# Altium schematic sheet stepper_motor_control_sch.SchDoc
size A3; PageSetup: Record=PageOptions|CenterHorizontal=True|CenterVertical=True|PrintScale=0.73|XCorrection=1.00|YCorrection=1.00|PrintKind=1|BorderSize=5000000|LeftOffset=0|BottomOffset=0|Orientation=2|PaperLength=1000|PaperWidth=1000|Scale=100|PaperSource=7|PrintQuality=600|MediaType=1|DitherType=10|PrintScaleMode=1|PaperKind=A4|PaperIndex=9
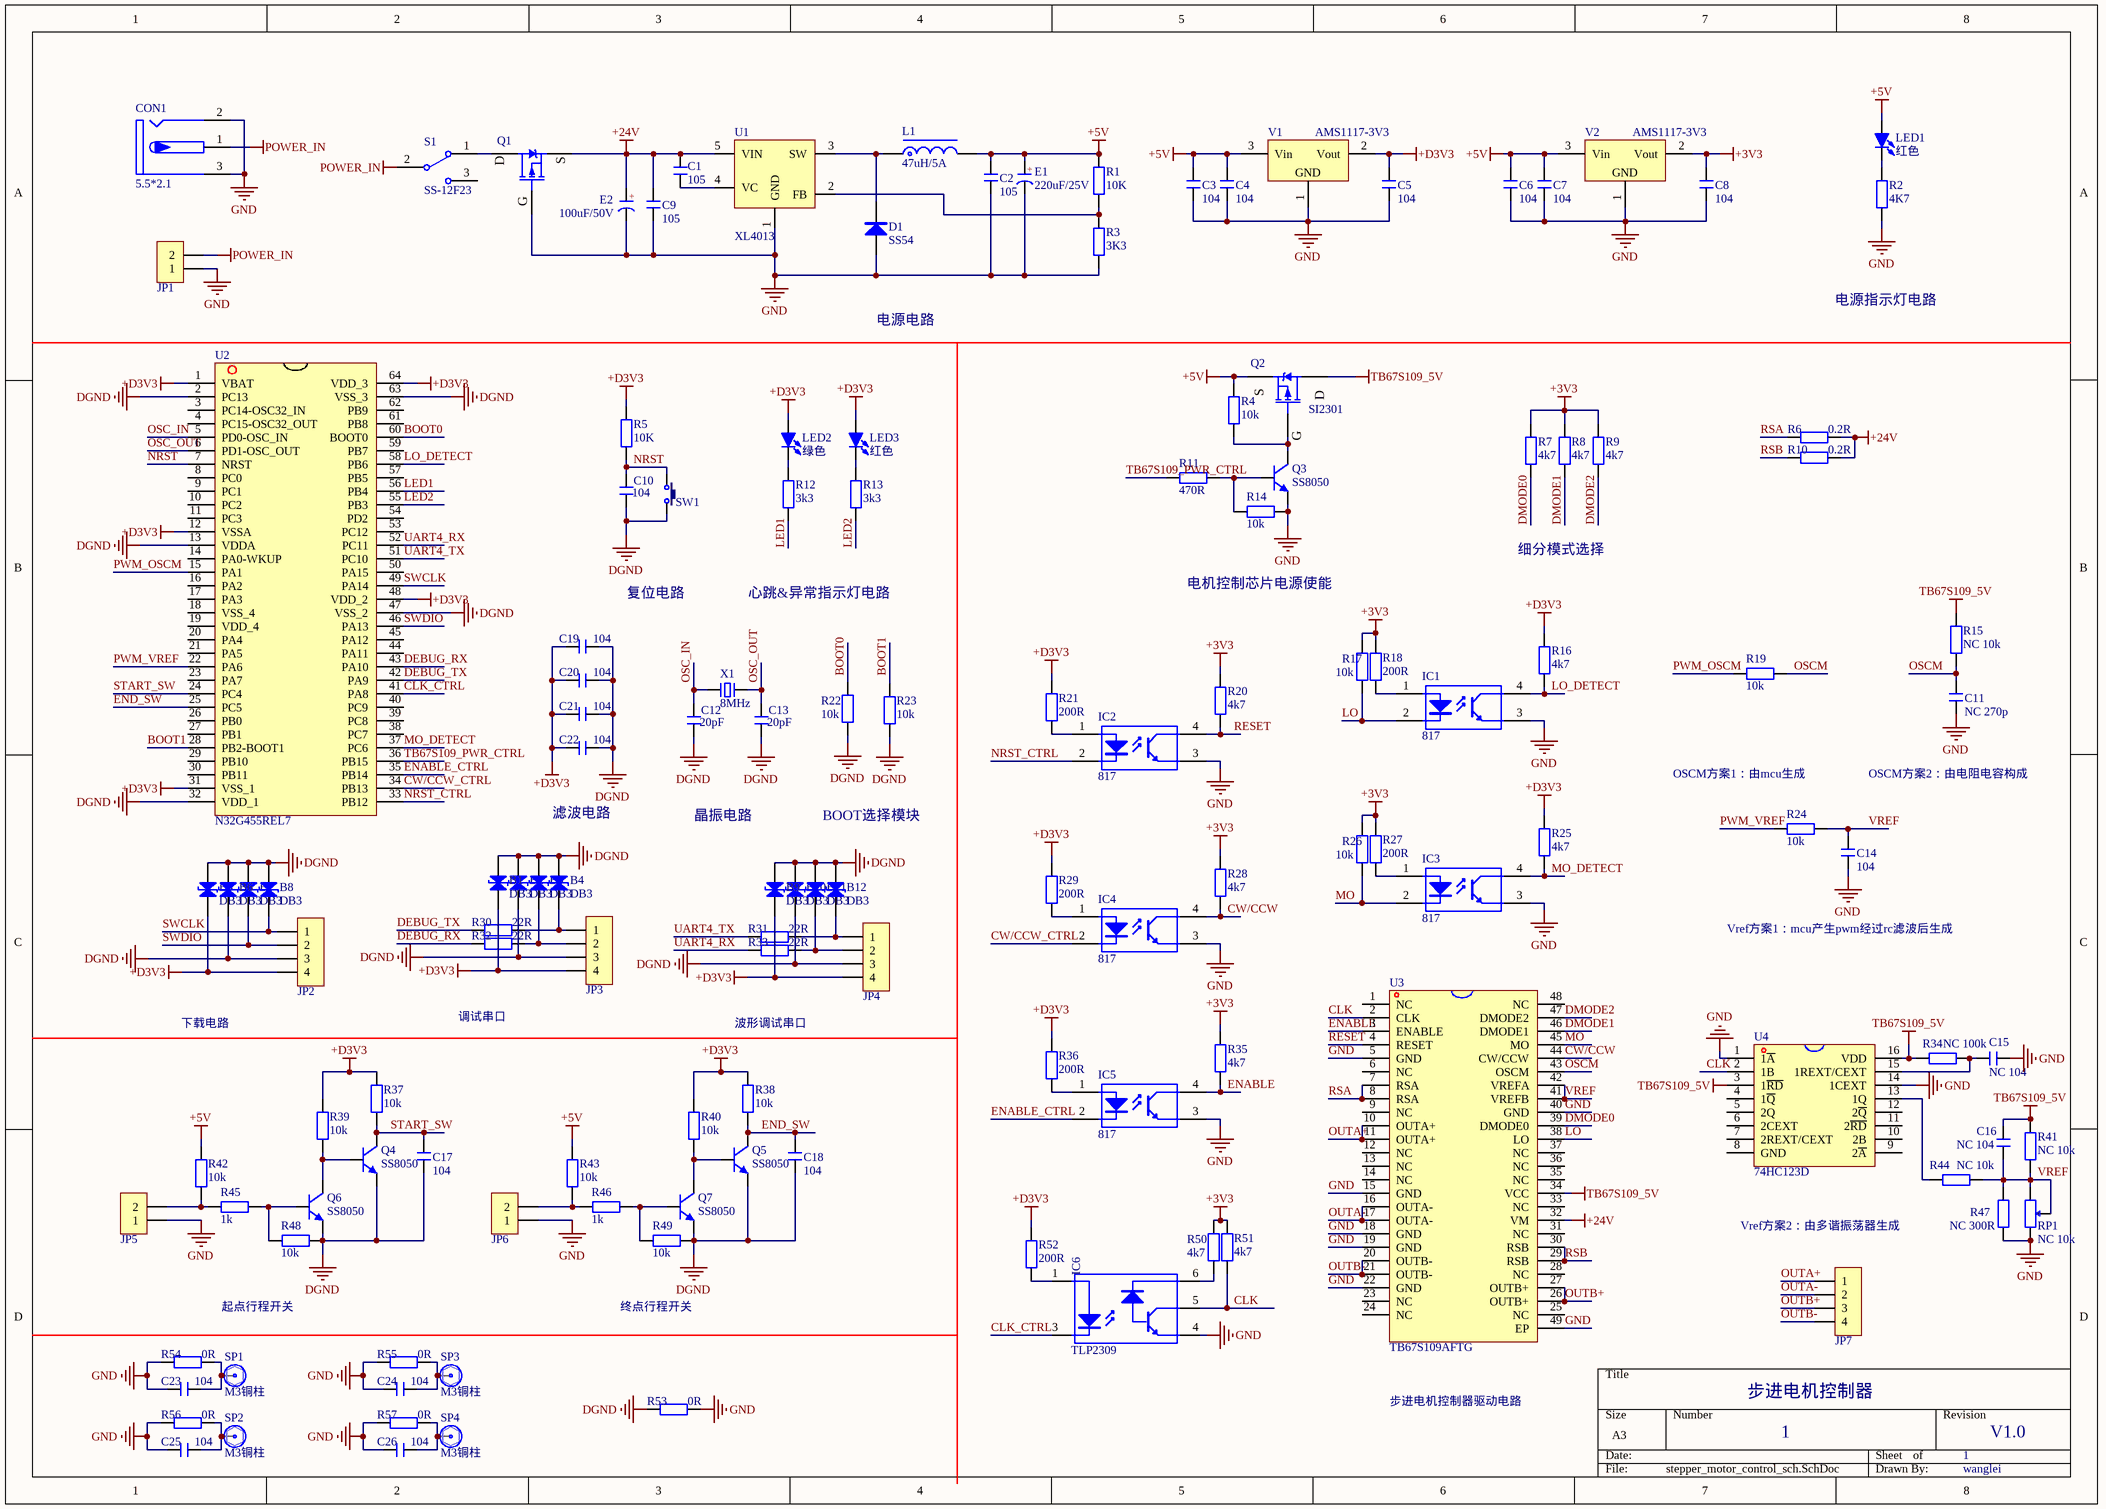
[diagram p0: stepper_motor_control_sch.SchDoc]

## Parts
B1  DB3  [SOD-323]
B2  DB3  [SOD-323]
B3  DB3  [SOD-323]
B4  DB3  [SOD-323]
B5  DB3  [SOD-323]
B6  DB3  [SOD-323]
B7  DB3  [SOD-323]
B8  DB3  [SOD-323]
B9  DB3  [SOD-323]
B10  DB3  [SOD-323]
B11  DB3  [SOD-323]
B12  DB3  [SOD-323]
C1  105  [C 0603_M]
C2  105  [C 0603_M]
C3  104  [C 0603_M]
C4  104  [C 0603_M]
C5  104  [C 0603_M]
C6  104  [C 0603_M]
C7  104  [C 0603_M]
C8  104  [C 0603_M]
C9  105  [C 0603_M]
C10  104  [C 0603_M]
C11  NC 270p  [C 0603_M]
C12  20pF  [C 0603_M]
C13  20pF  [C 0603_M]
C14  104  [C 0603_M]
C15  NC 104  [C 0603_M]
C16  NC 104  [C 0603_M]
C17  104  [C 0603_M]
C18  104  [C 0603_M]
C19  104  [C 0603_M]
C20  104  [C 0603_M]
C21  104  [C 0603_M]
C22  104  [C 0603_M]
C23  104  [C 0603_M]
C24  104  [C 0603_M]
C25  104  [C 0603_M]
C26  104  [C 0603_M]
CON1  5.5*2.1  [DC-005]
D1  SS54  [SMB]
E1  220uF/25V  [CAP 2.5*6.3*11.2 - BK]
E2  100uF/50V  [CAP 3.5*8*11.5 - BK]
IC1  817  [SMD]
IC2  817  [SMD]
IC3  817  [SMD]
IC4  817  [SMD]
IC5  817  [SMD]
IC6  TLP2309  [SO-6]
JP1  HDR-1X2  [KF350-2P]  (value not drawn)
JP2  HDR-1X4  [MX 1.25-WS-4P]  (value not drawn)
JP3  HDR-1X4  [MX 1.25-WS-4P]  (value not drawn)
JP4  HDR-1X4  [MX 1.25-WS-4P]  (value not drawn)
JP5  HDR-1X2  [XH2.54-LI-2P]  (value not drawn)
JP6  HDR-1X2  [XH2.54-LI-2P]  (value not drawn)
JP7  HDR-1X4  [KF350-4P]  (value not drawn)
L1  47uH/5A  [LMR135]
LED1  红色  [LED 0805W]
LED2  绿色  [LED 0805W]
LED3  红色  [LED 0805W]
Q1  D15P05  [TO252]  (value not drawn)
Q2  SI2301  [SOT23-3N]
Q3  SS8050  [SOT23-3N]
Q4  SS8050  [SOT23-3N]
Q5  SS8050  [SOT23-3N]
Q6  SS8050  [SOT23-3N]
Q7  SS8050  [SOT23-3N]
R1  10K  [R 0603_M]
R2  4K7  [R 0603_M]
R3  3K3  [R 0603_M]
R4  10k  [R 0603_M]
R5  10K  [R 0603_M]
R6  0.2R  [R 2010_M]
R7  4k7  [R 0603_M]
R8  4k7  [R 0603_M]
R9  4k7  [R 0603_M]
R10  0.2R  [R 2010_M]
R11  470R  [R 0603_M]
R12  3k3  [R 0603_M]
R13  3k3  [R 0603_M]
R14  10k  [R 0603_M]
R15  NC 10k  [R 0603_M]
R16  4k7  [R 0603_M]
R17  10k  [R 0603_M]
R18  200R  [R 0603_M]
R19  10k  [R 0603_M]
R20  4k7  [R 0603_M]
R21  200R  [R 0603_M]
R22  10k  [R 0603_M]
R23  10k  [R 0603_M]
R24  10k  [R 0603_M]
R25  4k7  [R 0603_M]
R26  10k  [R 0603_M]
R27  200R  [R 0603_M]
R28  4k7  [R 0603_M]
R29  200R  [R 0603_M]
R30  22R  [R 0603_M]
R31  22R  [R 0603_M]
R32  22R  [R 0603_M]
R33  22R  [R 0603_M]
R34  NC 100k  [R 0603_M]
R35  4k7  [R 0603_M]
R36  200R  [R 0603_M]
R37  10k  [R 0603_M]
R38  10k  [R 0603_M]
R39  10k  [R 0603_M]
R40  10k  [R 0603_M]
R41  NC 10k  [R 0603_M]
R42  10k  [R 0603_M]
R43  10k  [R 0603_M]
R44  NC 10k  [R 0603_M]
R45  1k  [R 0603_M]
R46  1k  [R 0603_M]
R47  NC 300R  [R 0603_M]
R48  10k  [R 0603_M]
R49  10k  [R 0603_M]
R50  4k7  [R 0603_M]
R51  4k7  [R 0603_M]
R52  200R  [R 0603_M]
R53  0R  [R 0603_M]
R54  0R  [R 0603_M]
R55  0R  [R 0603_M]
R56  0R  [R 0603_M]
R57  0R  [R 0603_M]
RP1  NC 10k  [3303W]
S1  SS-12F23  [SK12D07VG3]
SP1  M3铜柱  [M3x4+6_N]
SP2  M3铜柱  [M3x4+6_N]
SP3  M3铜柱  [M3x4+6_N]
SP4  M3铜柱  [M3x4+6_N]
SW1  3x6x5  [TSW SMD-3*6*2.5]  (value not drawn)
U1  XL4013  [TO252-5]
U2  N32G455REL7  [LQFP64 10x10_M]
U3  TB67S109AFTG  [QFN48]
U4  74HC123D  [SOP16_L]
V1  AMS1117-3V3  [SOT223_M]
V2  AMS1117-3V3  [SOT223_M]
X1  8MHz  [OSC HC-49SMD]

## Nets
+3V3: C8.1 R7.2 R8.2 R9.2 R17.1 R18.1 R20.2 R26.1 R27.1 R28.2 R35.2 R50.1 R51.1 V2.2(Vout)
+5V: C2.1 C3.1 C4.1 C6.1 C7.1 E1.1(A) L1.2 LED1.1(A) Q2.2(S) R1.2 R4.2 R42.2 R43.2 V1.3(Vin) V2.3(Vin)
+24V: C1.1 C9.1 E2.1(A) Q1.3(S) R6.2 R10.2 U1.5(VIN) U3.32(VM)
+D3V3: B1.2(K) B5.2(K) B9.2(K) C5.1 C19.2 C20.2 C21.2 C22.2 JP2.4 JP3.4 JP4.4 LED2.1(A) LED3.1(A) R5.2 R16.2 R21.1 R25.2 R29.1 R36.1 R37.1 R38.1 R39.1 R40.1 R52.1 U2.1(VBAT) U2.12(VSSA) U2.31(VSS_1) U2.48(VDD_2) U2.64(VDD_3) V1.2(Vout)
DGND: B1.1(A) B2.1(A) B2.2(K) B3.1(A) B4.1(A) B5.1(A) B6.1(A) B6.2(K) B7.1(A) B8.1(A) B9.1(A) B10.1(A) B10.2(K) B11.1(A) B12.1(A) C10.1 C12.1 C13.1 C17.2 C18.2 C19.1 C20.1 C21.1 C22.1 JP2.3 JP3.3 JP4.3 Q4.2(E) Q5.2(E) Q6.2(E) Q7.2(E) R22.1 R23.1 R48.1 R49.1 R53.1 SW1.2 U2.2(PC13) U2.13(VDDA) U2.32(VDD_1) U2.47(VSS_2) U2.63(VSS_3)
GND: C2.2 C3.2 C4.2 C5.2 C6.2 C7.2 C8.2 C9.2 C11.2 C14.2 C15.2 C23.1 C24.1 C25.1 C26.1 CON1.2 CON1.3 D1.1(A) E1.2(K) E2.2(K) IC1.3(E) IC2.3(E) IC3.3(E) IC4.3(E) IC5.3(E) IC6.4(GND) JP1.1 JP5.1 JP6.1 Q1.1(G) Q3.2(E) R2.1 R3.1 R14.2 R47.2 R53.2 R54.1 R55.1 R56.1 R57.1 RP1.3 U1.1(GND) U3.5(GND) U3.15(GND) U3.18(GND) U3.19(GND) U3.22(GND) U3.40(GND) U3.49(EP) U4.1(1~{A}) U4.14(1CEXT) V1.1(GND) V2.1(GND)
POWER_IN: CON1.1 JP1.2 S1.2
TB67S109_5V: C16.2 Q2.3(D) R15.2 R34.2 R41.1 U3.34(VCC) U4.3(1~{RD}) U4.16(VDD)
BOOT0: R22.2 U2.60(BOOT0)
BOOT1: R23.2 U2.28(PB2-BOOT1)
CLK: IC6.5(VO) R51.2 U3.2(CLK) U4.2(1B)
CLK_CTRL: IC6.3(CA) U2.41(PA8)
CW/CCW: IC4.4(C) R28.1 U3.44(CW/CCW)
CW/CCW_CTRL: IC4.2(K) U2.34(PB13)
DEBUG_RX: R32.1 U2.43(PA10)
DEBUG_TX: R30.1 U2.42(PA9)
DMODE0: R7.1 U3.39(DMODE0)
DMODE1: R8.1 U3.46(DMODE1)
DMODE2: R9.1 U3.47(DMODE2)
ENABLE: IC5.4(C) R35.1 U3.3(ENABLE)
ENABLE_CTRL: IC5.2(K) U2.35(PB14)
END_SW: C18.1 Q5.3(C) R38.2 U2.25(PC5)
LED1: R12.1 U2.56(PB4)
LED2: R13.1 U2.55(PB3)
LO: IC1.2(K) R17.2 U3.38(LO)
LO_DETECT: IC1.4(C) R16.1 U2.58(PB6)
MO: IC3.2(K) R26.2 U3.45(MO)
MO_DETECT: IC3.4(C) R25.1 U2.37(PC6)
NRST: C10.2 R5.1 SW1.1 U2.7(NRST)
NRST_CTRL: IC2.2(K) U2.33(PB12)
OSC_IN: C12.2 U2.5(PD0-OSC_IN) X1.1
OSC_OUT: C13.2 U2.6(PD1-OSC_OUT) X1.2
OSCM: C11.1 R15.1 R19.1 U3.43(OSCM)
OUTA+: JP7.1 U3.10(OUTA+) U3.11(OUTA+)
OUTA-: JP7.2 U3.16(OUTA-) U3.17(OUTA-)
OUTB+: JP7.3 U3.26(OUTB+) U3.27(OUTB+)
OUTB-: JP7.4 U3.20(OUTB-) U3.21(OUTB-)
PWM_OSCM: R19.2 U2.15(PA1)
PWM_VREF: R24.2 U2.22(PA6)
RESET: IC2.4(C) R20.1 U3.4(RESET)
RSA: R6.1 U3.7(RSA) U3.8(RSA)
RSB: R10.1 U3.29(RSB) U3.30(RSB)
START_SW: C17.1 Q4.3(C) R37.2 U2.24(PC4)
SWCLK: B8.2(K) JP2.1 U2.49(PA14)
SWDIO: B7.2(K) JP2.2 U2.46(PA13)
TB67S109_PWR_CTRL: R11.2 U2.36(PB15)
UART4_RX: R33.1 U2.52(PC11)
UART4_TX: R31.1 U2.51(PC10)
VREF: C14.1 C16.1 R24.1 R41.2 R44.1 R47.1 RP1.1 RP1.2 U3.41(VREFB) U3.42(VREFA)
NetB3_2: B3.2(K) JP3.2 R32.2
NetB4_2: B4.2(K) JP3.1 R30.2
NetB11_2: B11.2(K) JP4.2 R33.2
NetB12_2: B12.2(K) JP4.1 R31.2
NetC1_2: C1.2 U1.4(VC)
NetC15_1: C15.1 R34.1 U4.15(1REXT/CEXT)
NetC23_2: C23.2 R54.2 SP1.1
NetC24_2: C24.2 R55.2 SP3.1
NetC25_2: C25.2 R56.2 SP2.1
NetC26_2: C26.2 R57.2 SP4.1
NetD1_2: D1.2(K) L1.1 U1.3(SW)
NetIC1_1: IC1.1(A) R18.2
NetIC2_1: IC2.1(A) R21.2
NetIC3_1: IC3.1(A) R27.2
NetIC4_1: IC4.1(A) R29.2
NetIC5_1: IC5.1(A) R36.2
NetIC6_1: IC6.1(AN) R52.2
NetIC6_6: IC6.6(VCC) R50.2
NetJP5_2: JP5.2 R42.1 R45.2
NetJP6_2: JP6.2 R43.1 R46.2
NetLED1_2: LED1.2(K) R2.2
NetLED2_2: LED2.2(K) R12.2
NetLED3_2: LED3.2(K) R13.2
NetQ1_2: Q1.2(D) S1.1
NetQ2_1: Q2.1(G) Q3.3(C) R4.1
NetQ3_1: Q3.1(B) R11.1 R14.1
NetQ4_1: Q4.1(B) Q6.3(C) R39.2
NetQ5_1: Q5.1(B) Q7.3(C) R40.2
NetQ6_1: Q6.1(B) R45.1 R48.2
NetQ7_1: Q7.1(B) R46.1 R49.2
NetR1_1: R1.1 R3.2 U1.2(FB)
NetR44_2: R44.2 U4.13(1Q)

Not connected (* = marked no-connect by the designer): S1 3; U2 3(PC14-OSC32_IN) 4(PC15-OSC32_OUT) 8(PC0) 9(PC1) 10(PC2) 11(PC3) 14(PA0-WKUP) 16(PA2) 17(PA3) 18(VSS_4) 19(VDD_4) 20(PA4) 21(PA5) 23(PA7) 26(PB0) 27(PB1) 29(PB10) 30(PB11) 38(PC7) 39(PC8) 40(PC9) 44(PA11) 45(PA12) 50(PA15) 53(PC12) 54(PD2) 57(PB5) 59(PB7) 61(PB8) 62(PB9); U3 1(NC) 6(NC) 9(NC) 12(NC) 13(NC) 14(NC) 23(NC) 24(NC) 25(NC) 28(NC) 31(NC) 33(NC) 35(NC) 36(NC) 37(NC) 48(NC); U4 4(1~{Q}) 5(2Q) 6(2CEXT) 7(2REXT/CEXT) 8(GND) 9(2~{A}) 10(2B) 11(2~{RD}) 12(2~{Q})

## Notes on the sheet
- 电源指示灯电路
- 电源电路
- 电机控制芯片电源使能
- 细分模式选择
- 复位电路
- 心跳&异常指示灯电路
- OSCM方案1：由mcu生成
- OSCM方案2：由电阻电容构成
- 滤波电路
- 晶振电路
- BOOT选择模块
- Vref方案1：mcu产生pwm经过rc滤波后生成
- 下载电路
- 调试串口
- 波形调试串口
- Vref方案2：由多谐振荡器生成
- 起点行程开关
- 终点行程开关
- 步进电机控制器
- 步进电机控制器驱动电路
- 1
- V1.0
- wanglei
- (in symbol C-CAP) +

## Library data of the parts
B1-B12 = DB3: 双向触发二极管
C1-C26 = C: 无极性贴片电容; 版权归属: 源创客; BOM名称: 无极性贴片电容; 学习资源: www.ooocke.com
CON1 = DC-005P: 带屏蔽DC电源接口; 版权归属: 源创客; BOM名称: 带屏蔽DC电源接口; 学习资源: www.ooocke.com
D1 = SS24: 肖特基二极管; 版权归属: 源创客; 属性: 40V/2A; BOM名称: 肖特基二极管; 学习资源: www.ooocke.com
E1 E2 = C-CAP: 直插电解电容; 版权归属: 源创客; BOM名称: 直插电解电容; 学习资源: www.ooocke.com
IC1-IC5 = 817: 线性光耦; 版权归属: 源创客; BOM名称: 线性光耦; 学习资源: www.ooocke.com
IC6 = TLP2309: 高速光耦
JP1 JP5 JP6 = Header 2: 2P接插件; 版权归属: 源创客; BOM名称: 2P接插件; 学习资源: www.ooocke.com
JP2-JP4 JP7 = Header 4: 4P接插件; 版权归属: 源创客; BOM名称: 4P接插件; 学习资源: www.ooocke.com
L1 = L-MR: 功率磁环电感; 版权归属: 源创客; BOM名称: 功率磁环电感; 学习资源: www.ooocke.com
LED1-LED3 = LED-SMD: 贴片LED; 版权归属: 源创客; BOM名称: 贴片LED; 学习资源: www.ooocke.com
Q1 = D15P05: P沟道场效应管; 版权归属: 源创客; BOM名称: P沟道场效应管; 学习资源: www.ooocke.com
Q2 = SI2301: P沟道场效应管; 版权归属: 源创客; BOM名称: P沟道场效应管; 学习资源: www.ooocke.com
Q3-Q7 = 8050-SMD: 高频放大-NPN型; 版权归属: 源创客; 属性: 40V 1.5A 1W 100MHZ; BOM名称: 高频放大-NPN型; 学习资源: www.ooocke.com
R1-R57 = R: 贴片电阻; 版权归属: 源创客; BOM名称: 贴片电阻; 学习资源: www.ooocke.com
RP1 = RP-SMD: 贴片电位器; 版权归属: 源创客; BOM名称: 贴片电位器; 学习资源: www.ooocke.com
S1 = SSW-1P: 1路波动开关; BOM名称: 波动开关; 版权归属: 源创客; 学习资源: www.ooocke.com
SP1-SP4 = 铜柱加头大焊盘: 铜柱; 版权归属: 源创客; BOM名称: 铜柱; 学习资源: www.ooocke.com
SW1 = TSW 3x6: 3x6轻触开关; 版权归属: 源创客; BOM名称: 3x6轻触开关; 学习资源: www.ooocke.com
U1 = XL4013: DC-DC降压芯片 最大4A输出
U2 = N32G455REL7: 国民技术32位mcu IO:64
U3 = TB67S109AFTG: 时钟控制双极性步进电机驱动器
U4 = 74HC123D: 单稳态多谐振荡器
V1 V2 = AMS1117: 三端稳压芯片; BOM名称: 稳压芯片; 版权归属: 源创客; 学习资源: www.ooocke.com
X1 = XTAL-2P: 2脚无源脚晶振; 版权归属: 源创客; BOM名称: 2脚无源脚晶振; 学习资源: www.ooocke.com